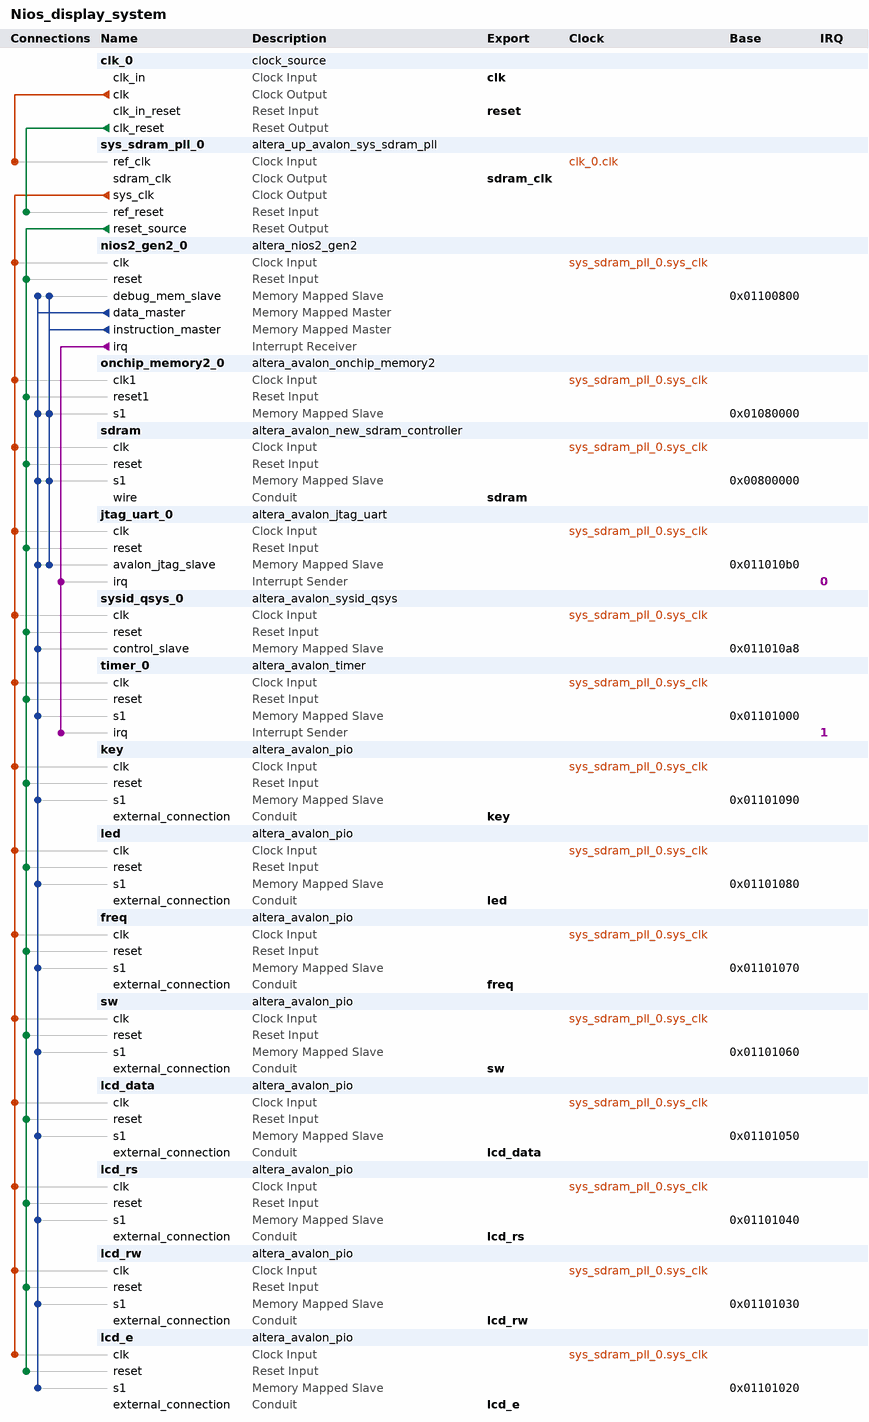
[diagram p0: system contents]
# Platform Designer (Qsys) system Nios_display_system, Cyclone V 5CSEMA5F31C6
# Parameters at their usual value, and those the tool derives, are not listed.
package require -exact qsys 16.0
create_system Nios_display_system
set_project_property DEVICE_FAMILY {Cyclone V}
set_project_property DEVICE 5CSEMA5F31C6

add_instance clk_0 clock_source 16.0
set_instance_parameter_value clk_0 clockFrequency 50000000

add_instance sys_sdram_pll_0 altera_up_avalon_sys_sdram_pll 15.1
set_instance_parameter_value sys_sdram_pll_0 CV_boards DE1-SoC
set_instance_parameter_value sys_sdram_pll_0 gui_outclk 50.0
set_instance_parameter_value sys_sdram_pll_0 gui_refclk 50.0

add_instance nios2_gen2_0 altera_nios2_gen2 16.0
set_instance_parameter_value nios2_gen2_0 dcache_size 2048
set_instance_parameter_value nios2_gen2_0 exceptionSlave sdram.s1
set_instance_parameter_value nios2_gen2_0 icache_size 4096
set_instance_parameter_value nios2_gen2_0 impl Fast
set_instance_parameter_value nios2_gen2_0 resetSlave sdram.s1

add_instance onchip_memory2_0 altera_avalon_onchip_memory2 16.0
set_instance_parameter_value onchip_memory2_0 dataWidth 32
set_instance_parameter_value onchip_memory2_0 dualPort false
set_instance_parameter_value onchip_memory2_0 initMemContent true
set_instance_parameter_value onchip_memory2_0 initializationFileName onchip_mem.hex
set_instance_parameter_value onchip_memory2_0 memorySize 350000

add_instance sdram altera_avalon_new_sdram_controller 16.0
set_instance_parameter_value sdram TAC 5.5
set_instance_parameter_value sdram TRCD 20.0
set_instance_parameter_value sdram TRP 20.0
set_instance_parameter_value sdram casLatency 3
set_instance_parameter_value sdram columnWidth 8
set_instance_parameter_value sdram dataWidth 16
set_instance_parameter_value sdram generateSimulationModel false
set_instance_parameter_value sdram model single_Micron_MT48LC4M32B2_7_chip
set_instance_parameter_value sdram numberOfBanks 4
set_instance_parameter_value sdram numberOfChipSelects 1
set_instance_parameter_value sdram powerUpDelay 100.0
set_instance_parameter_value sdram refreshPeriod 15.625
set_instance_parameter_value sdram rowWidth 12

add_instance jtag_uart_0 altera_avalon_jtag_uart 16.0
set_instance_parameter_value jtag_uart_0 simInteractiveOptions NO_INTERACTIVE_WINDOWS

add_instance sysid_qsys_0 altera_avalon_sysid_qsys 16.0
set_instance_parameter_value sysid_qsys_0 id 1

add_instance timer_0 altera_avalon_timer 16.0
set_instance_parameter_value timer_0 alwaysRun true
set_instance_parameter_value timer_0 fixedPeriod true
set_instance_parameter_value timer_0 period 100
set_instance_parameter_value timer_0 periodUnits USEC
set_instance_parameter_value timer_0 snapshot false

add_instance key altera_avalon_pio 16.0
set_instance_parameter_value key direction Input
set_instance_parameter_value key width 3

add_instance led altera_avalon_pio 16.0
set_instance_parameter_value led direction Output
set_instance_parameter_value led width 10

add_instance freq altera_avalon_pio 16.0
set_instance_parameter_value freq direction Input
set_instance_parameter_value freq width 32

add_instance sw altera_avalon_pio 16.0
set_instance_parameter_value sw direction Input
set_instance_parameter_value sw width 10

add_instance lcd_data altera_avalon_pio 16.0
set_instance_parameter_value lcd_data direction Bidir
set_instance_parameter_value lcd_data width 8

add_instance lcd_rs altera_avalon_pio 16.0
set_instance_parameter_value lcd_rs direction Output
set_instance_parameter_value lcd_rs width 1

add_instance lcd_rw altera_avalon_pio 16.0
set_instance_parameter_value lcd_rw direction Output
set_instance_parameter_value lcd_rw width 1

add_instance lcd_e altera_avalon_pio 16.0
set_instance_parameter_value lcd_e direction Output
set_instance_parameter_value lcd_e width 1

# connections
add_connection clk_0.clk sys_sdram_pll_0.ref_clk clock
add_connection sys_sdram_pll_0.sys_clk freq.clk clock
add_connection sys_sdram_pll_0.sys_clk jtag_uart_0.clk clock
add_connection sys_sdram_pll_0.sys_clk key.clk clock
add_connection sys_sdram_pll_0.sys_clk lcd_data.clk clock
add_connection sys_sdram_pll_0.sys_clk lcd_e.clk clock
add_connection sys_sdram_pll_0.sys_clk lcd_rs.clk clock
add_connection sys_sdram_pll_0.sys_clk lcd_rw.clk clock
add_connection sys_sdram_pll_0.sys_clk led.clk clock
add_connection sys_sdram_pll_0.sys_clk nios2_gen2_0.clk clock
add_connection sys_sdram_pll_0.sys_clk onchip_memory2_0.clk1 clock
add_connection sys_sdram_pll_0.sys_clk sdram.clk clock
add_connection sys_sdram_pll_0.sys_clk sw.clk clock
add_connection sys_sdram_pll_0.sys_clk sysid_qsys_0.clk clock
add_connection sys_sdram_pll_0.sys_clk timer_0.clk clock
add_connection clk_0.clk_reset sys_sdram_pll_0.ref_reset reset
add_connection sys_sdram_pll_0.reset_source freq.reset reset
add_connection sys_sdram_pll_0.reset_source jtag_uart_0.reset reset
add_connection sys_sdram_pll_0.reset_source key.reset reset
add_connection sys_sdram_pll_0.reset_source lcd_data.reset reset
add_connection sys_sdram_pll_0.reset_source lcd_e.reset reset
add_connection sys_sdram_pll_0.reset_source lcd_rs.reset reset
add_connection sys_sdram_pll_0.reset_source lcd_rw.reset reset
add_connection sys_sdram_pll_0.reset_source led.reset reset
add_connection sys_sdram_pll_0.reset_source nios2_gen2_0.reset reset
add_connection sys_sdram_pll_0.reset_source onchip_memory2_0.reset1 reset
add_connection sys_sdram_pll_0.reset_source sdram.reset reset
add_connection sys_sdram_pll_0.reset_source sw.reset reset
add_connection sys_sdram_pll_0.reset_source sysid_qsys_0.reset reset
add_connection sys_sdram_pll_0.reset_source timer_0.reset reset
add_connection nios2_gen2_0.data_master freq.s1 avalon
set_connection_parameter_value nios2_gen2_0.data_master/freq.s1 baseAddress 0x01101070
add_connection nios2_gen2_0.data_master jtag_uart_0.avalon_jtag_slave avalon
set_connection_parameter_value nios2_gen2_0.data_master/jtag_uart_0.avalon_jtag_slave baseAddress 0x011010b0
add_connection nios2_gen2_0.data_master key.s1 avalon
set_connection_parameter_value nios2_gen2_0.data_master/key.s1 baseAddress 0x01101090
add_connection nios2_gen2_0.data_master lcd_data.s1 avalon
set_connection_parameter_value nios2_gen2_0.data_master/lcd_data.s1 baseAddress 0x01101050
add_connection nios2_gen2_0.data_master lcd_e.s1 avalon
set_connection_parameter_value nios2_gen2_0.data_master/lcd_e.s1 baseAddress 0x01101020
add_connection nios2_gen2_0.data_master lcd_rs.s1 avalon
set_connection_parameter_value nios2_gen2_0.data_master/lcd_rs.s1 baseAddress 0x01101040
add_connection nios2_gen2_0.data_master lcd_rw.s1 avalon
set_connection_parameter_value nios2_gen2_0.data_master/lcd_rw.s1 baseAddress 0x01101030
add_connection nios2_gen2_0.data_master led.s1 avalon
set_connection_parameter_value nios2_gen2_0.data_master/led.s1 baseAddress 0x01101080
add_connection nios2_gen2_0.data_master nios2_gen2_0.debug_mem_slave avalon
set_connection_parameter_value nios2_gen2_0.data_master/nios2_gen2_0.debug_mem_slave baseAddress 0x01100800
add_connection nios2_gen2_0.data_master onchip_memory2_0.s1 avalon
set_connection_parameter_value nios2_gen2_0.data_master/onchip_memory2_0.s1 baseAddress 0x01080000
add_connection nios2_gen2_0.data_master sdram.s1 avalon
set_connection_parameter_value nios2_gen2_0.data_master/sdram.s1 baseAddress 0x00800000
add_connection nios2_gen2_0.data_master sw.s1 avalon
set_connection_parameter_value nios2_gen2_0.data_master/sw.s1 baseAddress 0x01101060
add_connection nios2_gen2_0.data_master sysid_qsys_0.control_slave avalon
set_connection_parameter_value nios2_gen2_0.data_master/sysid_qsys_0.control_slave baseAddress 0x011010a8
add_connection nios2_gen2_0.data_master timer_0.s1 avalon
set_connection_parameter_value nios2_gen2_0.data_master/timer_0.s1 baseAddress 0x01101000
add_connection nios2_gen2_0.instruction_master jtag_uart_0.avalon_jtag_slave avalon
set_connection_parameter_value nios2_gen2_0.instruction_master/jtag_uart_0.avalon_jtag_slave baseAddress 0x011010b0
add_connection nios2_gen2_0.instruction_master nios2_gen2_0.debug_mem_slave avalon
set_connection_parameter_value nios2_gen2_0.instruction_master/nios2_gen2_0.debug_mem_slave baseAddress 0x01100800
add_connection nios2_gen2_0.instruction_master onchip_memory2_0.s1 avalon
set_connection_parameter_value nios2_gen2_0.instruction_master/onchip_memory2_0.s1 baseAddress 0x01080000
add_connection nios2_gen2_0.instruction_master sdram.s1 avalon
set_connection_parameter_value nios2_gen2_0.instruction_master/sdram.s1 baseAddress 0x00800000
add_connection nios2_gen2_0.irq jtag_uart_0.irq interrupt
set_connection_parameter_value nios2_gen2_0.irq/jtag_uart_0.irq irqNumber 0
add_connection nios2_gen2_0.irq timer_0.irq interrupt
set_connection_parameter_value nios2_gen2_0.irq/timer_0.irq irqNumber 1

# exported interfaces
add_interface clk clock sink
set_interface_property clk EXPORT_OF clk_0.clk_in
add_interface freq conduit end
set_interface_property freq EXPORT_OF freq.external_connection
add_interface key conduit end
set_interface_property key EXPORT_OF key.external_connection
add_interface lcd_data conduit end
set_interface_property lcd_data EXPORT_OF lcd_data.external_connection
add_interface lcd_e conduit end
set_interface_property lcd_e EXPORT_OF lcd_e.external_connection
add_interface lcd_rs conduit end
set_interface_property lcd_rs EXPORT_OF lcd_rs.external_connection
add_interface lcd_rw conduit end
set_interface_property lcd_rw EXPORT_OF lcd_rw.external_connection
add_interface led conduit end
set_interface_property led EXPORT_OF led.external_connection
add_interface reset reset sink
set_interface_property reset EXPORT_OF clk_0.clk_in_reset
add_interface sdram conduit end
set_interface_property sdram EXPORT_OF sdram.wire
add_interface sdram_clk clock source
set_interface_property sdram_clk EXPORT_OF sys_sdram_pll_0.sdram_clk
add_interface sw conduit end
set_interface_property sw EXPORT_OF sw.external_connection

set_interconnect_requirement {$system} qsys_mm.clockCrossingAdapter HANDSHAKE
set_interconnect_requirement {$system} qsys_mm.enableEccProtection FALSE
set_interconnect_requirement {$system} qsys_mm.insertDefaultSlave FALSE
set_interconnect_requirement {$system} qsys_mm.maxAdditionalLatency 1

save_system Nios_display_system.qsys
